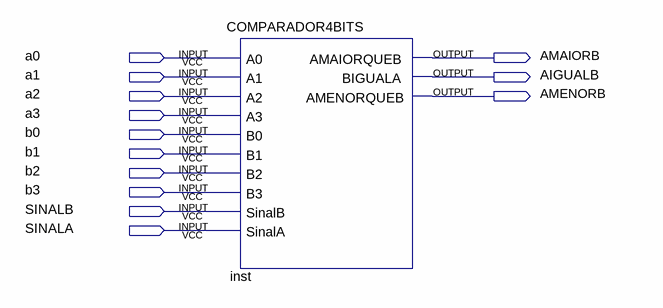
[diagram p0: schematic sheet]
// Quartus schematic COMPARADORCOMPLETO.bdf as structural Verilog: 1 symbols, 13 pins
module COMPARADORCOMPLETO (
  input  a0,
  input  a1,
  input  a2,
  input  a3,
  input  b0,
  input  b1,
  input  b2,
  input  b3,
  input  SINALB,
  input  SINALA,
  output AMAIORB,
  output AIGUALB,
  output AMENORB
);

  COMPARADOR4BITS inst (
    .A0(a0), .A1(a1), .A2(a2), .A3(a3), .B0(b0), .B1(b1), .B2(b2), .B3(b3), .SinalB(SINALB), .SinalA(SINALA),
    .AMAIORQUEB(AMAIORB), .BIGUALA(AIGUALB), .AMENORQUEB(AMENORB));
endmodule
